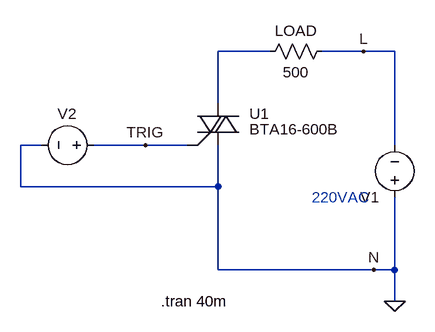
[diagram p0: schematic BTA16-600B.asc]
BTA16-600B.asc, the LTspice schematic file:
Version 4.1
SHEET 1 880 680
WIRE 384 -16 304 -16
WIRE 528 -16 464 -16
WIRE 576 -16 528 -16
WIRE 304 64 304 -16
WIRE 32 128 0 128
WIRE 192 128 112 128
WIRE 256 128 192 128
WIRE 576 128 576 -16
WIRE 0 192 0 128
WIRE 304 192 304 128
WIRE 304 192 0 192
WIRE 304 320 304 192
WIRE 544 320 304 320
WIRE 576 320 576 208
WIRE 576 320 544 320
WIRE 576 368 576 320
FLAG 576 368 0
FLAG 192 128 TRIG
FLAG 528 -16 L
FLAG 544 320 N
SYMBOL voltage 576 224 R180
WINDOW 123 0 0 Left 0
WINDOW 39 0 0 Left 0
WINDOW 3 -47 -16 Invisible 2
SYMATTR Value SINE(0 310 50)
SYMATTR InstName V1
SYMBOL res 480 -32 R90
WINDOW 0 0 56 VBottom 2
WINDOW 3 32 56 VTop 2
SYMATTR InstName LOAD
SYMATTR Value 500
SYMBOL voltage 128 128 R90
WINDOW 123 0 0 Left 0
WINDOW 39 0 0 Left 0
WINDOW 0 -48 42 VRight 2
WINDOW 3 -52 -173 Invisible 2
SYMATTR InstName V2
SYMATTR Value PULSE(0 12 2.5m 1n 1n 100u 10m)
SYMBOL MyLib\\Thyristor_TRIAC\\BTA16-600B 272 64 R0
SYMATTR InstName U1
TEXT 216 368 Left 2 !.tran 40m
TEXT 448 208 Left 2 ;220VAC

The netlist it stands for:
* BTA16-600B.asc
V1 0 L SINE(0 310 50)
R§LOAD L N001 500
V2 TRIG 0 PULSE(0 12 2.5m 1n 1n 100u 10m)
X§U1 N001 TRIG 0 BTA16-600B  ; pins MT2 G MT1
.tran 40m
* 220VAC
.lib MyLib/Thyristor_TRIAC/_TRIAC_ST.lib
.backanno
.end